# Altium project ESC_S1.PrjPcb
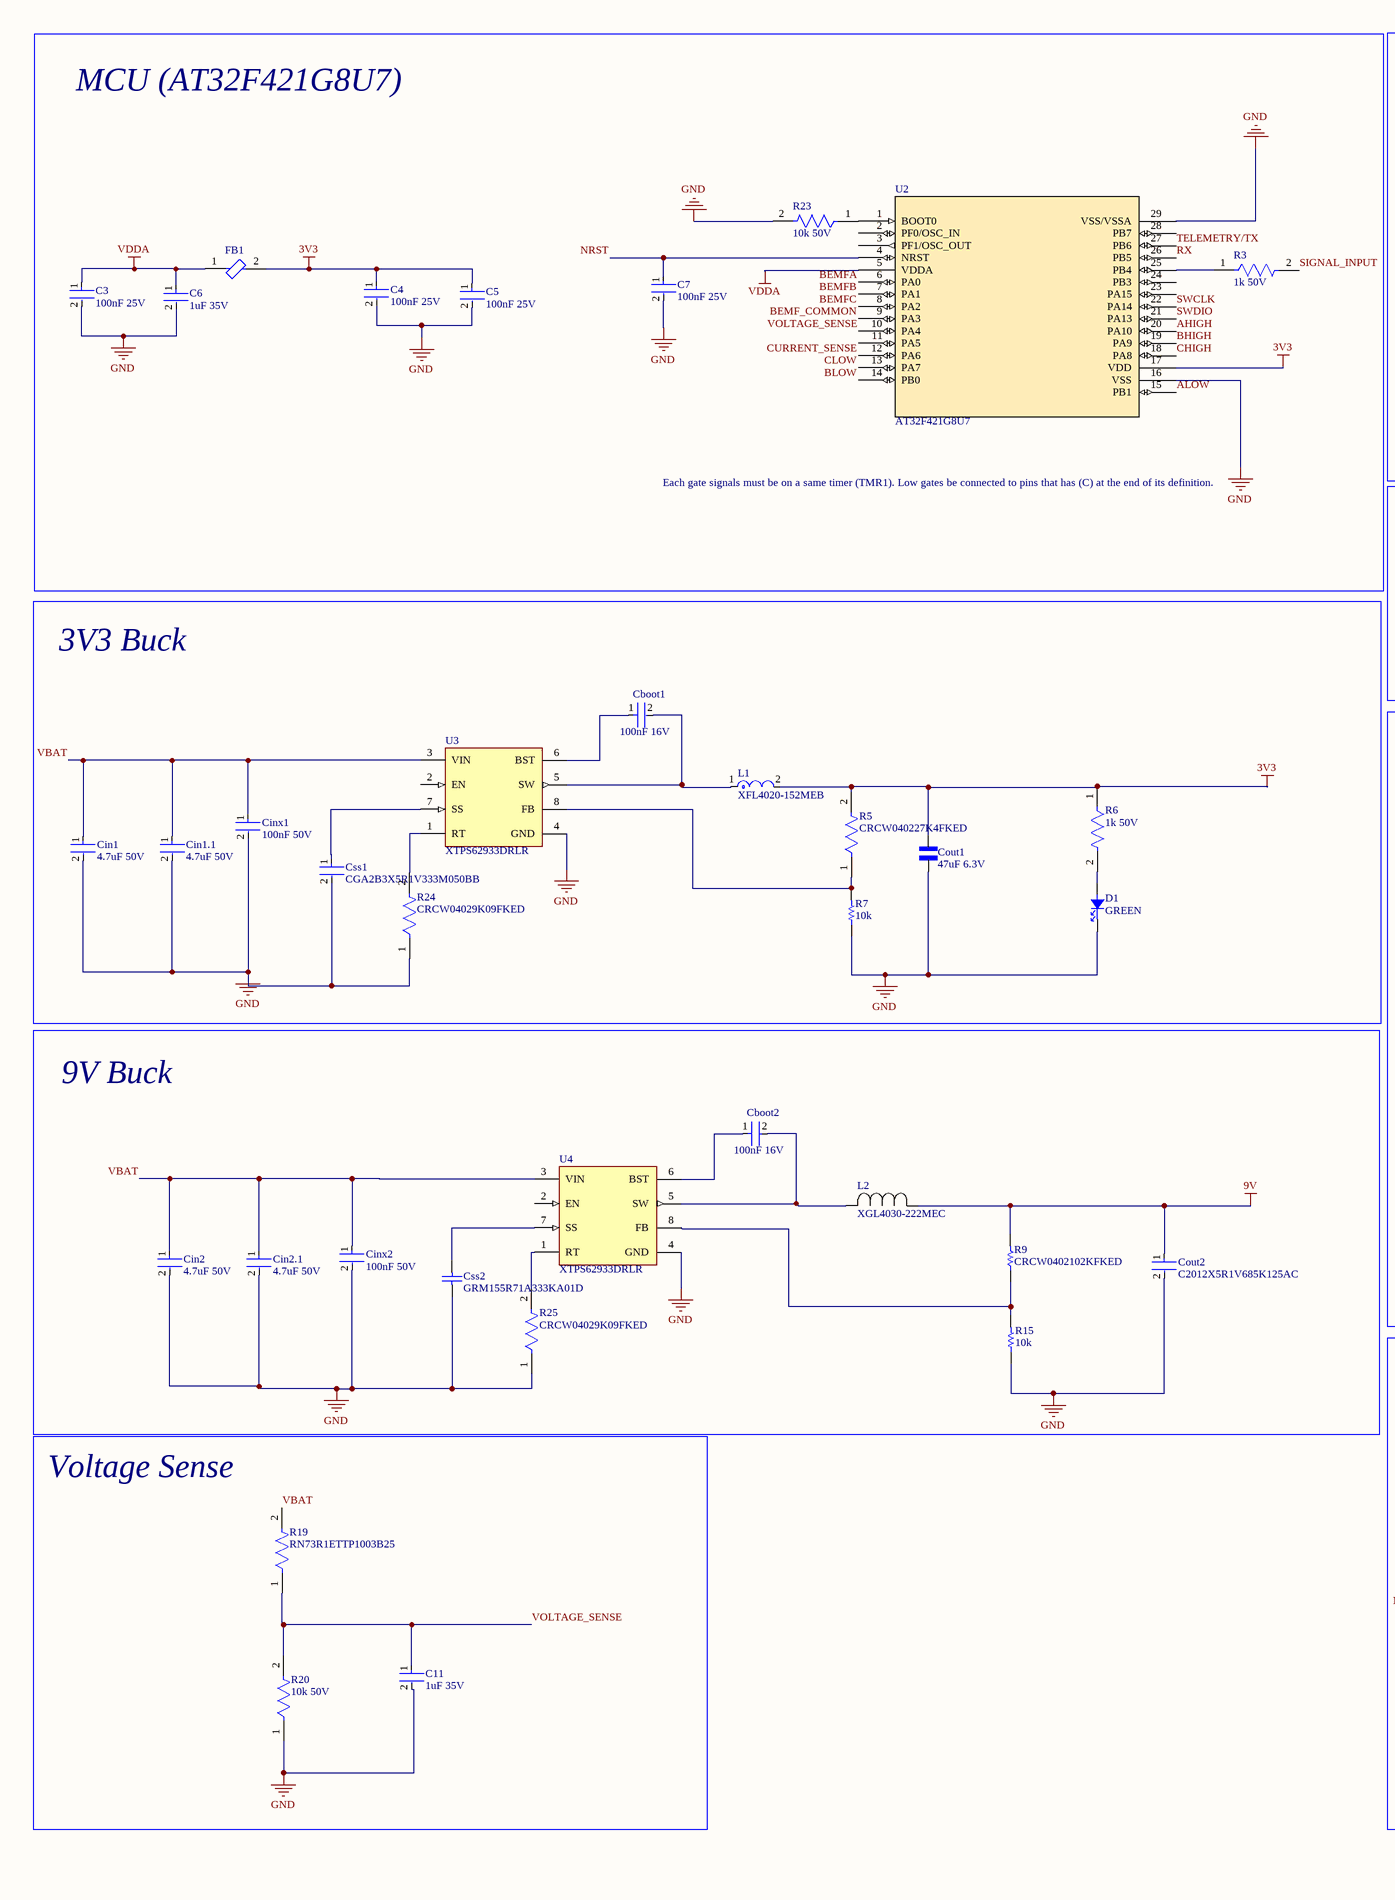
[diagram p0: ESC_S1.SchDoc, left]
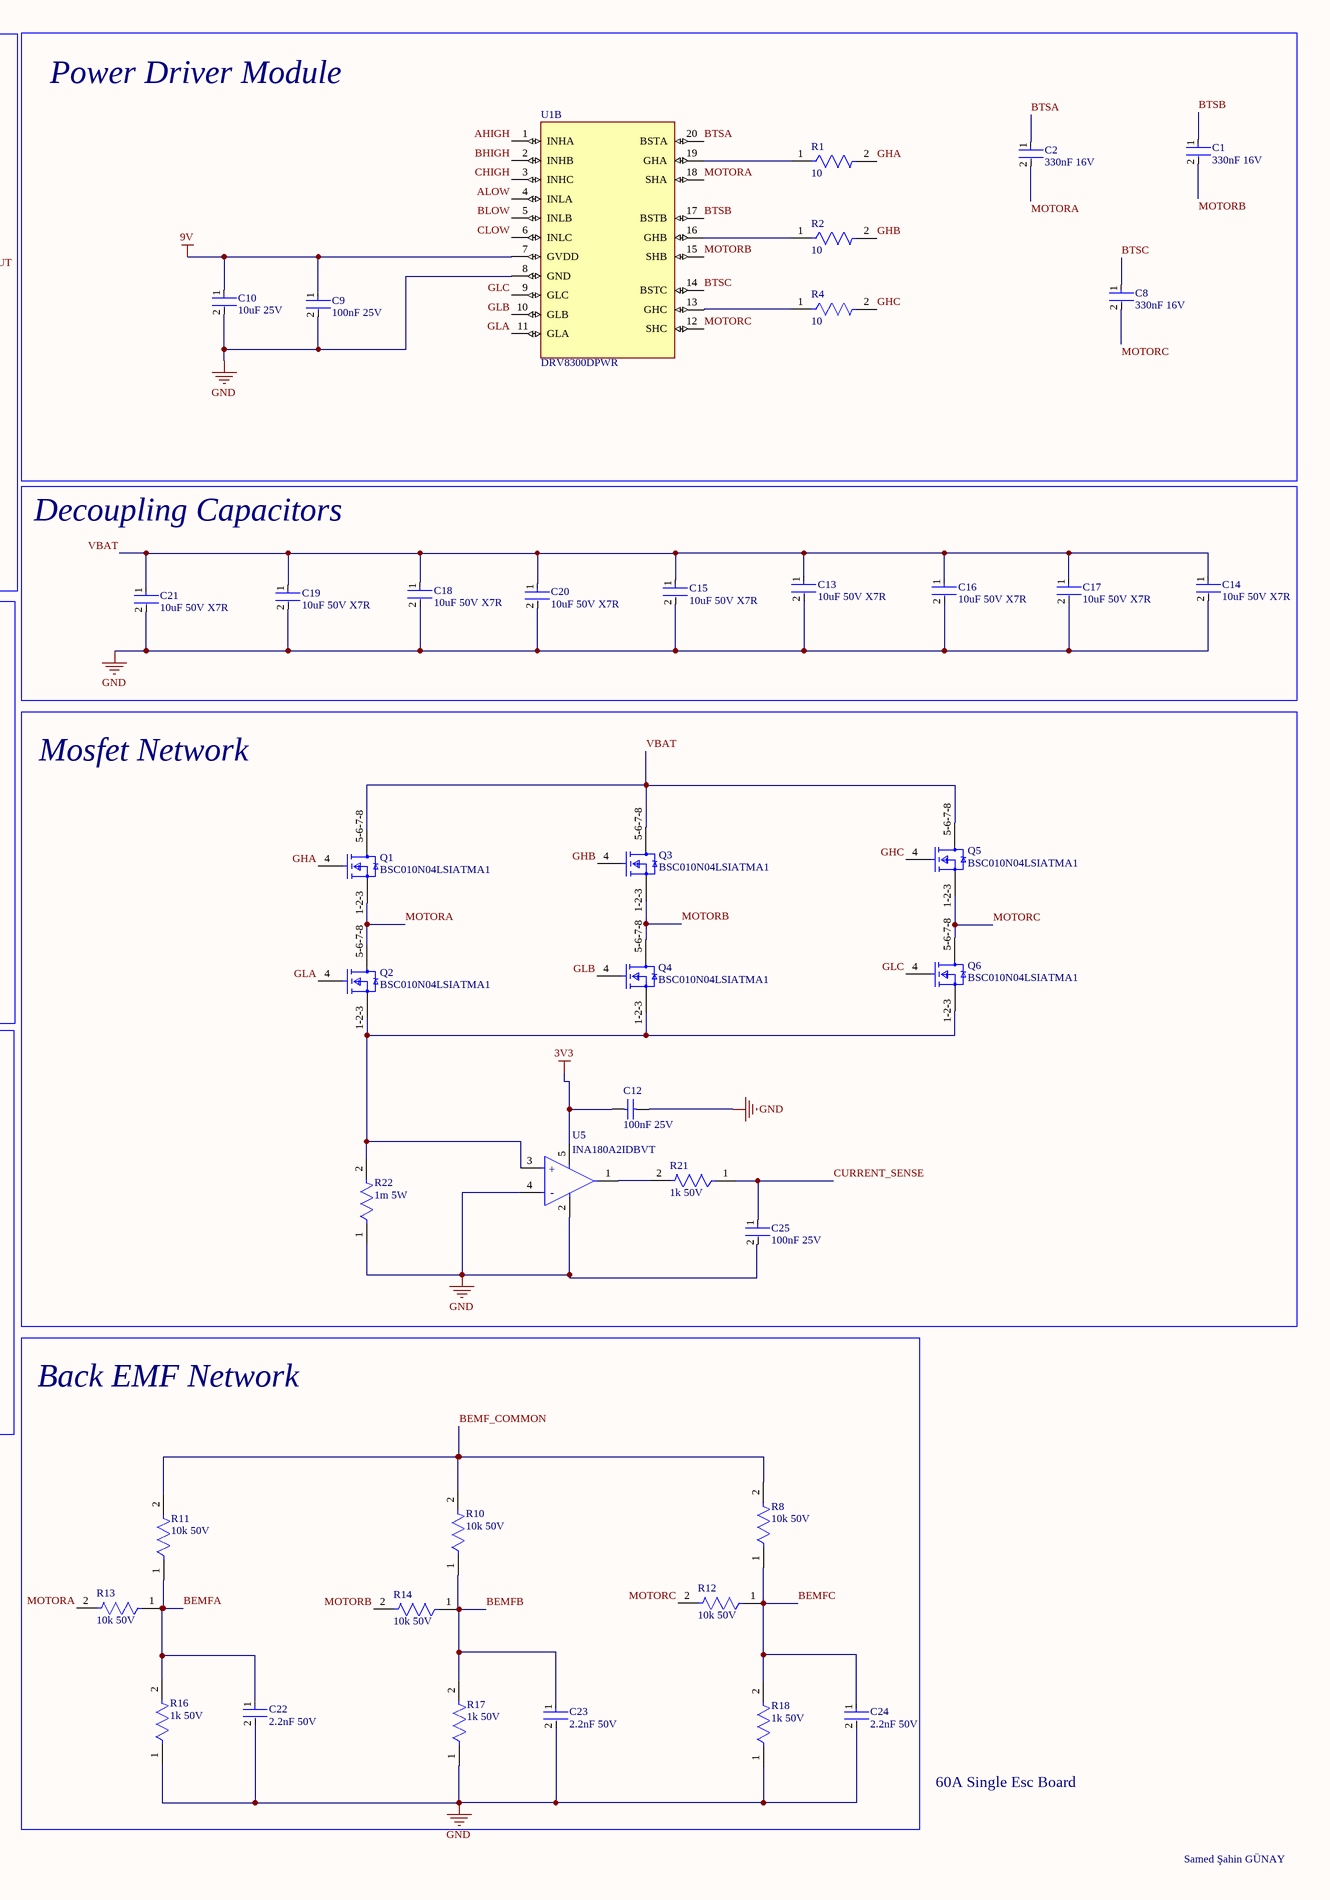
[diagram p1: ESC_S1.SchDoc, right]
1 sheet, 77 parts. Net scope: global (net labels, ports and power ports of the same name join across sheets).
Board file: ESC_S1.PcbDoc

## Sheet ESC_S1.SchDoc
size A2; SheetNumber: 1; SheetTotal: 1

### Parts
C1  330nF 16V  [FP-C0603C-CF-MFG]
C2  330nF 16V  [FP-C0603C-CF-MFG]
C3  100nF 25V  [FP-C0402-BB-MFG]
C4  100nF 25V  [FP-C0402-BB-MFG]
C5  100nF 25V  [FP-C0402-BB-MFG]
C6  1uF 35V  [FP-0402-L_1_0_0_2-W_0_5_0-MFG]
C7  100nF 25V  [FP-C0402-BB-MFG]
C8  330nF 16V  [FP-C0603C-CF-MFG]
C9  100nF 25V  [FP-C0402-BB-MFG]
C10  10uF 25V  [FP-ZRB18AR61E106ME01L-MFG]
C11  1uF 35V  [FP-0402-L_1_0_0_2-W_0_5_0-MFG]
C12  100nF 25V  [CAPC1608X87X35ML15T15]
C13  10uF 50V X7R  [FP-CL31B106KBHNNNE-MFG]
C14  10uF 50V X7R  [FP-CL31B106KBHNNNE-MFG]
C15  10uF 50V X7R  [FP-CL31B106KBHNNNE-MFG]
C16  10uF 50V X7R  [FP-CL31B106KBHNNNE-MFG]
C17  10uF 50V X7R  [FP-CL31B106KBHNNNE-MFG]
C18  10uF 50V X7R  [FP-CL31B106KBHNNNE-MFG]
C19  10uF 50V X7R  [FP-CL31B106KBHNNNE-MFG]
C20  10uF 50V X7R  [FP-CL31B106KBHNNNE-MFG]
C21  10uF 50V X7R  [FP-CL31B106KBHNNNE-MFG]
C22  2.2nF 50V  [FP-CL286-IPC_C]
C23  2.2nF 50V  [FP-CL286-IPC_C]
C24  2.2nF 50V  [FP-CL286-IPC_C]
C25  100nF 25V  [FP-C0402-BB-MFG]
Cboot1  100nF 16V  [FP-C0402-BB-MFG]
Cboot2  100nF 16V  [FP-C0402-BB-MFG]
Cin1  4.7uF 50V  [FP-CC0805-0_85-MFG]
Cin1.1  4.7uF 50V  [FP-CC0805-0_85-MFG]
Cin2  4.7uF 50V  [FP-CC0805-0_85-MFG]
Cin2.1  4.7uF 50V  [FP-CC0805-0_85-MFG]
Cinx1  100nF 50V  [FP-CGA3E-0_3-0_1-IPC_A]
Cinx2  100nF 50V  [FP-CGA3E-0_3-0_1-IPC_A]
Cout1  47uF 6.3V  [CAPC1608X100N]
Cout2  C2012X5R1V685K125AC  [FP-C2012-125-0_2-IPC_B]
Css1  CGA2B3X5R1V333M050BB  [FP-CGA2B-IPC_A]
Css2  GRM155R71A333KA01D  [CAPC1005X55X25NL05T10]
D1  GREEN  [LED0402G]
FB1  BLM15BD601SZ1D  [FP-BLM15-0_05-IPC_B]  (value not drawn)
L1  XFL4020-152MEB  [FP-XFL4020-MFG]
L2  XGL4030-222MEC  [IND_XGL4030_COC]
Q1  BSC010N04LSIATMA1  [FP-PG-TDSON-8-MFG]
Q2  BSC010N04LSIATMA1  [FP-PG-TDSON-8-MFG]
Q3  BSC010N04LSIATMA1  [FP-PG-TDSON-8-MFG]
Q4  BSC010N04LSIATMA1  [FP-PG-TDSON-8-MFG]
Q5  BSC010N04LSIATMA1  [FP-PG-TDSON-8-MFG]
Q6  BSC010N04LSIATMA1  [FP-PG-TDSON-8-MFG]
R1  10  [FP-AC0603-MFG]
R2  10  [FP-AC0603-MFG]
R3  1k 50V  [FP-AC0402-IPC_C]
R4  10  [FP-AC0603-MFG]
R5  CRCW040227K4FKED  [FP-CRCW0402-e3-MFG]
R6  1k 50V  [FP-AC0402-IPC_C]
R7  10k  [RESC1005X40X25ML05T10]
R8  10k 50V  [FP-MCS0402-IPC_C]
R9  CRCW0402102KFKED  [RESC1005X40X25ML05T05]
R10  10k 50V  [FP-MCS0402-IPC_C]
R11  10k 50V  [FP-MCS0402-IPC_C]
R12  10k 50V  [FP-MCS0402-IPC_C]
R13  10k 50V  [FP-MCS0402-IPC_C]
R14  10k 50V  [FP-MCS0402-IPC_C]
R15  10k  [RESC1005X40X25ML05T10]
R16  1k 50V  [FP-AC0402-IPC_C]
R17  1k 50V  [FP-AC0402-IPC_C]
R18  1k 50V  [FP-AC0402-IPC_C]
R19  RN73R1ETTP1003B25  [FP-RN73R1E-MFG]
R20  10k 50V  [FP-MCS0402-IPC_C]
R21  1k 50V  [FP-AC0402-IPC_C]
R22  1m 5W  [FP-WSLF2512-0_43-MFG]
R23  10k 50V  [FP-MCS0402-IPC_C]
R24  CRCW04029K09FKED  [FP-CRCW0402-e3-IPC_A]
R25  CRCW04029K09FKED  [FP-CRCW0402-e3-IPC_A]
U1  DRV8300DPWR  [SOP65P640X120-20N]  (part B of 2)
U2  AT32F421G8U7  [QFN28_4x4_ART]
U3  XTPS62933DRLR  [FP-DRL0008A-MFG]
U4  XTPS62933DRLR  [FP-DRL0008A-MFG]
U5  INA180A2IDBVT  [FP-DBV0005A-MFG]

### Blocks framed on the sheet
MCU (AT32F421G8U7): C3-C7 FB1 R3 R23 U2
Power Driver Module: C1 C2 C8-C10 R1 R2 R4 U1
Decoupling Capacitors: C13-C21
3V3 Buck: Cboot1 Cin1 Cin1.1 Cinx1 Cout1 Css1 D1 L1 R5-R7 R24 U3
Mosfet Network: C12 C25 Q1-Q6 R21 R22 U5
9V Buck: Cboot2 Cin2 Cin2.1 Cinx2 Cout2 Css2 L2 R9 R15 R25 U4
Back EMF Network: C22-C24 R8 R10-R14 R16-R18
Voltage Sense: C11 R19 R20

### Nets
3V3: C4.1 C5.1 C12.2 Cout1.2 FB1.2 L1.2 R5.2 R6.1 U2.17(VDD) U5.5(VS)
9V: C9.1 C10.1 Cout2.1 L2.1 R9.2 U1.7(GVDD)
GND: C3.2 C4.2 C5.2 C6.2 C7.2 C9.2 C10.2 C11.2 C12.1 C13.2 C14.2 C15.2 C16.2 C17.2 C18.2 C19.2 C20.2 C21.2 C22.2 C23.2 C24.2 C25.2 Cin1.2 Cin1.1.2 Cin2.2 Cin2.1.2 Cinx1.2 Cinx2.2 Cout1.1 Cout2.2 Css1.2 Css2.1 D1.1 R7.1 R15.1 R16.1 R17.1 R18.1 R20.1 R22.1 R23.2 R24.1 R25.1 U1.8(GND) U2.16(VSS) U2.29(VSS/VSSA) U3.4(GND) U4.4(GND) U5.2(GND) U5.4(IN-)
VDDA: C3.1 C6.1 FB1.1 U2.5(VDDA)
AHIGH: U1.1(INHA) U2.20(PA10)
ALOW: U1.4(INLA) U2.15(PB1)
BEMF_COMMON: R8.2 R10.2 R11.2 U2.9(PA3)
BEMFA: C22.1 R11.1 R13.1 R16.2 U2.6(PA0)
BEMFB: C23.1 R10.1 R14.1 R17.2 U2.7(PA1)
BEMFC: C24.1 R8.1 R12.1 R18.2 U2.8(PA2)
BHIGH: U1.2(INHB) U2.19(PA9)
BLOW: U1.5(INLB) U2.14(PB0)
BTSA: C2.1 U1.20(BSTA)
BTSB: C1.1 U1.17(BSTB)
BTSC: C8.1 U1.14(BSTC)
CHIGH: U1.3(INHC) U2.18(PA8)
CLOW: U1.6(INLC) U2.13(PA7)
CURRENT_SENSE: C25.1 R21.1 U2.12(PA6)
GHA: Q1.4(G) R1.2
GHB: Q3.4(G) R2.2
GHC: Q5.4(G) R4.2
GLA: Q2.4(G) U1.11(GLA)
GLB: Q4.4(G) U1.10(GLB)
GLC: Q6.4(G) U1.9(GLC)
MOTORA: C2.2 Q1.1-2-3(S) Q2.5-6-7-8(D) R13.2 U1.18(SHA)
MOTORB: C1.2 Q3.1-2-3(S) Q4.5-6-7-8(D) R14.2 U1.15(SHB)
MOTORC: C8.2 Q5.1-2-3(S) Q6.5-6-7-8(D) R12.2 U1.12(SHC)
NRST: C7.1 U2.4(NRST)
RX: U2.26(PB5)
SIGNAL_INPUT: R3.2
SWCLK: U2.22(PA14)
SWDIO: U2.21(PA13)
TELEMETRY/TX: U2.27(PB6)
VBAT: C13.1 C14.1 C15.1 C16.1 C17.1 C18.1 C19.1 C20.1 C21.1 Cin1.1 Cin1.1.1 Cin2.1 Cin2.1.1 Cinx1.1 Cinx2.1 Q1.5-6-7-8(D) Q3.5-6-7-8(D) Q5.5-6-7-8(D) R19.2 U3.3(VIN) U4.3(VIN)
VOLTAGE_SENSE: C11.1 R19.1 R20.2 U2.10(PA4)
NetCboot1_1: Cboot1.1 U3.6(BST)
NetCboot1_2: Cboot1.2 L1.1 U3.5(SW)
NetCboot2_1: Cboot2.1 U4.6(BST)
NetCboot2_2: Cboot2.2 L2.2 U4.5(SW)
NetCss1_1: Css1.1 U3.7(SS)
NetCss2_2: Css2.2 U4.7(SS)
NetD1_2: D1.2 R6.2
NetQ2_1-2-3: Q2.1-2-3(S) Q4.1-2-3(S) Q6.1-2-3(S) R22.2 U5.3(IN+)
NetR1_1: R1.1 U1.19(GHA)
NetR2_1: R2.1 U1.16(GHB)
NetR3_1: R3.1 U2.25(PB4)
NetR4_1: R4.1 U1.13(GHC)
NetR5_1: R5.1 R7.2 U3.8(FB)
NetR9_1: R9.1 R15.2 U4.8(FB)
NetR21_2: R21.2 U5.1(OUT)
NetR23_1: R23.1 U2.1(BOOT0)
NetR24_2: R24.2 U3.1(RT)
NetR25_2: R25.2 U4.1(RT)

Not connected (* = marked no-connect by the designer): U2 2(PF0/OSC_IN) 3(PF1/OSC_OUT) 11(PA5) 23(PA15) 24(PB3) 28(PB7); U3 2(EN); U4 2(EN)

### Notes on the sheet
- Each gate signals must be on a same timer (TMR1). Low gates be connected to pins that has (C) at the end of its definition.
- 60A Single Esc Board
- Samed Şahin GÜNAY
- (in symbol CMP-04895-000174-1) +; -

### Library data of the parts
C1 C2 C8 = CMP-03020-005049-1: CAP CER 0.33UF 16V X7R 0603; Manufacturer Part Number: C0603C334M4RACTU; Manufacturer: KEMET; Capacitance: 0.33 μF; Temperature Coefficient: 30ppm/°C; Material: Ceramic; Tolerance: 0.2; Automotive Grade: Grade 1; Value: 0.33 μF; Digikey Description: CAP CER 0.33UF 16V X7R 0603; Octopart: https://octopart.com/c0603c334m4ractu-kemet-9139753; Lead Free: Yes; Temperature Range Low: -55°C; RoHS: TRUE; ComponentLink2Description: Datasheet; Voltage Rating: 16 V; Mouser Description: Multilayer Ceramic Capacitors MLCC - SMD/SMT 16volts 0.33uF X7R 20%; Category: Cap; Temperature Characteristic: X7R; ComponentLink2URL: https://api.kemet.com/component-edge/download/datasheet/C0603C100J5GACAUTO.pdf; Device Class L3: Ceramic Capacitors; Automotive: Yes; Temperature: -55°C to +125°C; Temperature Range High: +125°C; Height: 0.87mm; Device Class L2: Capacitors; Package: C0603C-CF; Device Class L1: Passive Components
C3-C5 C7 C9 C25 = CMP-03020-014070-2: CAP CER 0.1UF 25V X5R 0402; Manufacturer: Kemet; Manufacturer Part Number: C0402C104M3PAC7867; Material: Ceramic; Tolerance: 0.2; Value: 0.10 μF; Temperature Coefficient: 15%; Height: 0.55mm; Category: Cap; Temperature: -55°C to +125°C; Automotive: No; Package: C0402-BB; Temperature Range Low: -55°C; ComponentLink2Description: Datasheet; Device Class L3: Ceramic Capacitors; ComponentLink2URL: https://content.kemet.com/datasheets/KEM_C1002_X7R_SMD.pdf; Octopart: https://octopart.com/c0402c104m3pac7867-kemet-84304880; Temperature Characteristic: X5R; RoHS: TRUE; Temperature Range High: +125°C; Device Class L1: Passive Components; Capacitance: 0.10 μF; Lead Free: Yes; Voltage Rating: 25 V; Ipc Land Pattern Name: CAPC10050X50; Device Class L2: Capacitors; Digikey Description: CAP CER 0.1UF 25V X5R 0402
C6 C11 = CMP-14477-003658-1: Ceramic Capacitor General Use 1uF ±10% 35V X6S 0402
C10 = CMP-06035-062385-2: CAP CER 10UF 25V X5R 0603; Tolerance: 20%; Min Operating Temperature: -55°C; Voltage: 25V; Case Code (Imperial): 0603; Case Code (Metric): 1608; Voltage Rating (DC): 25V; Max Operating Temperature: 85°C; Depth: 0.8mm; Thickness: 0.047inch; RoHS Compliant: Yes; Dielectric: X5R; Mount: Surface Mount; Voltage Rating: 25V; Length: 0.063inch; Height: 1mm; Packaging: Cut Tape; Capacitance: 10uF; REACH SVHC: No SVHC; Width: 0.031inch; Case/Package: 0603
C12 = CMP-2006-03295-1: Part Number: C0603T104K3RCLTU; Manufacturer: Kemet
C13-C21 = CMP-2000-07530-2: CAP CER 10UF 50V X7R 1206; Manufacturer: Samsung; Manufacturer Part Number: CL31B106KBHNNNE; Tolerance: 10%; Material: Ceramic; Temperature Coefficient: 15%; Temperature Characteristic: X7R; Digikey Description: CAP CER 10UF 50V X7R 1206; Device Class L1: Passive Components; Value: 10uF; Lead Free: Yes; Device Class L3: Ceramic Capacitors; Octopart: https://octopart.com/cl31b106kbhnnne-samsung-30507377; ComponentLink2URL: http://www.samsungsem.com/global/front/downloadcms.do?path=%2F%2Fglobal%2F%2Fsupport%2F%2Fproduct-search%2F%2Fmlcc%2F%2F__icsFiles%2F%2Fafieldfile%2F%2F2019%2F%2F06%2F%2F18&fileName=CL31B106KBHNNNE-19.pdf; Voltage Rating: 50V; Temperature Range Low: -55°C; RoHS: TRUE; Temperature: -55°C to +125°C; Category: Cap; ComponentLink2Description: Datasheet; Automotive: No; Device Class L2: Capacitors; Capacitance: 10uF; Height: 1.8mm; Temperature Range High: +125°C; Package: CL31B106KBHNNNE
C22-C24 = CMP-13271-000679-1: Cap Ceramic 2.2nF 50V X7R ±10% SMD 0402 +125°C Paper T/R; Min Operating Temperature: -55°C; Case/Package: 0402; Voltage Rating (DC): 50V; Packaging: Tape and Reel; Package Quantity: 1; Tolerance: 10%; Height: 0.5mm; Voltage Rating: 50V; Width: 0.02inch; Case Code (Imperial): 0402; Capacitance: 2.2nF; Depth: 0.5mm; Dielectric: X7R; Length: 0.039inch; Thickness: 0.022inch; Case Code (Metric): 1005; Mount: Surface Mount; Radiation Hardening: No; Max Operating Temperature: 125°C
Cboot1 Cboot2 = CMP-2008-03082-2: CAP CER 0.1UF 16V X7R 0402; Manufacturer Part Number: C0402C104K4RACAUTO; Manufacturer: Kemet; Temperature Coefficient: 15%; Tolerance: 0.1; Capacitance: 0.10 μF; Value: 0.10 μF; Device Class L3: Ceramic Capacitors; Voltage Rating: 16 V; Temperature Range High: +125°C; Device Class L2: Capacitors; Height: 0.55mm; Category: Cap; RoHS: TRUE; Temperature Characteristic: X7R; Octopart: https://octopart.com/c0402c104k4racauto-kemet-17309149; Digikey Description: CAP CER 0.1UF 16V X7R 0402; Device Class L1: Passive Components; Temperature Range Low: -55°C; Material: Ceramic; Mouser Description: Cap Ceramic 0.1uF 16V X7R 10% Pad SMD 0402 125C Automotive T/R; ComponentLink2Description: Datasheet; Automotive: No; Ipc Land Pattern Name: CAPC10050X50; ComponentLink2URL: https://content.kemet.com/datasheets/KEM_C1002_X7R_SMD.pdf; Lead Free: Yes; Temperature: -55°C to +125°C; Package: C0402-BB
Cin1 Cin1.1 Cin2 Cin2.1 = CMP-03422-000966-1: CAP CER 4.7UF 50V X5R 0805; Manufacturer: Yageo; Manufacturer Part Number: CC0805KKX5R9BB475; Tolerance: 0.1; Capacitance: 4.7 uF; Value: 4.7 uF; Height: 0.95mm; Category: Cap; ComponentLink2Description: Datasheet; Lead Free: Yes; Voltage Rating: 50 V; Device Class L2: Capacitors; Material: Ceramic; Temperature Range High: +85°C; ComponentLink2URL: http://www.yageo.com/documents/recent/UPY-GPHC_Y5V_6.3V-to-50V_8.pdf; Ipc Land Pattern Name: CAPC200125X85; Octopart: https://octopart.com/cc0805kkx5r9bb475-yageo-81932641; Temperature Range Low: -30°C; Digikey Description: CAP CER 4.7UF 50V X5R 0805; Package: CC0805-0.85; Device Class L1: Passive Components; RoHS: TRUE; Temperature Characteristic: X5R; Device Class L3: Ceramic Capacitors; Automotive: No; Temperature: -30°C to +85°C; Footprint Url: http://www.yageo.com/exep/pages/download/literatures/UPY-C_GEN_24.pdf
Cinx1 Cinx2 = CMP-2000-07546-2: Cap Ceramic 100nF 50V X7R 10% Pad SMD 0603 +125°C Automotive T/R; Weight: 7.1E-05oz; Composition: Ceramic; Max Operating Temperature: 125°C; Termination: SMD/SMT; Dielectric: X7R; Length: 1.6mm; Package Quantity: 1; REACH SVHC: No SVHC; Lead Free: Lead Free; Case Code (Metric): 1608; Min Operating Temperature: -55°C; Packaging: Tape and Reel; Tolerance: 10%; Voltage Rating: 50V; Case Code (Imperial): 0603; Capacitance: 100nF; Case/Package: 0603; Voltage Rating (DC): 50V; Depth: 0.8mm; Radiation Hardening: No; Ratings: AEC-Q200; Mount: Surface Mount; Voltage: 50V; Thickness: 0.035inch; Width: 0.8mm; Height: 0.8mm
Cout1 = MSASJ168BB5476MRCA01: 47uF 6.3V 20% Multilayer Ceramic Capacitor X5R 0603 (1608 Metric); MF: Taiyo Yuden; SnapEDA_Link: https://www.snapeda.com/parts/MSASJ168BB5476MRCA01/Taiyo+Yuden/view-part/?ref=snap; Package: 1608-2 TAIYO; Value: *; MP: MSASJ168BB5476MRCA01; Check_prices: https://www.snapeda.com/parts/MSASJ168BB5476MRCA01/Taiyo+Yuden/view-part/?ref=eda
Cout2 = CMP-08246-006695-1: Multilayer Ceramic Capacitors 6.8μF ±10% 35V X5R SMD 0805; Capacitance: 6.8uF; Case Code (Imperial): 0805; Width: 0.049inch; Thickness: 0.057inch; Case/Package: 0805; Packaging: Tape and Reel; Min Operating Temperature: -55°C; Dielectric Material: Ceramic; Lead Free: Lead Free; Case Code (Metric): 2012; Series: C; RoHS Compliant: Yes; Length: 0.079inch; Max Operating Temperature: 85°C; Mount: Surface Mount; Voltage Rating: 35V; Package Quantity: 2000; Tolerance: 10%; Voltage Rating (DC): 35V
Css1 = CMP-08246-000404-1: Cap Ceramic 33nF 35V X5R 20% Pad SMD 0402 +85°C Automotive T/R; Case Code (Metric): 1005; Max Operating Temperature: 85°C; Case Code (Imperial): 0402; Dielectric: X5R; Voltage Rating (DC): 35V; Voltage Rating: 35V; Length: 0.039inch; Tolerance: 20%; Package Quantity: 10000; Width: 0.5mm; Packaging: Tape and Reel; Thickness: 0.022inch; Height: 0.5mm; Weight: 2.3E-05oz; Capacitance: 33nF; Min Operating Temperature: -55°C; Mount: Surface Mount; Ratings: AEC-Q200; Case/Package: 0402
Css2 = CMP-2008-04594-1: Manufacturer: Murata; Part Number: GRM155R71A333KA01D
D1 = VLMG1500-GS08: LED YLW-GRN 0402 SMD; Manufacturer: Vishay; Color: Green,Yellow; Lens Color: Clear; Viewing Angle: 130°; Forward Current: 30mA; Forward Voltage: 2V; Luminous Intensity: 35mcd; Dominant Wavelength: 571nm; Test Current: 20mA; Number of Elements: 1; Power Dissipation: 75mW; Lens Style: Rectangular; Reverse Voltage: 5V; Supplier: Digikey; Supplier Part Number: VLMG1500-GS08CT-ND; Manufacturer Part Number: VLMG1500-GS08; RoHS: Yes; Category: LEDs; Stock: 98; Pricing: 1=0.34, 10=0.265, 100=0.119, 500=0.10746, 1000=0.08827 (USD); Mounting Technology: Surface Mount; Case/Package: 0402; Pins: 2; Case Code (Metric): 1005; Case Code (Imperial): 0402; Min Operating Temperature: -30°C; Max Operating Temperature: 85°C; Package Quantity: 1; Packaging: Tape and Reel; Illumination Color: Green; Wavelength: 571nm; Number of LEDs: 1; Power Rating: 75mW; Series: CHipLED; Length: 1mm; Width: 0.5mm; Height: 0.35mm; Depth: 0.5mm; Radiation Hardening: No; Lead Free: Lead Free; RoHS Compliant: Yes; Reach SVHC Compliant: Unknown; ComponentLink1URL: https://datasheet.ciiva.com/12071/vlmo1500-244705-12071911.pdf?src-supplier=Mouser; ComponentLink1Description: https://datasheet.ciiva.com/12071/vlmo1500-244705-12071911.pdf?src-supplier=Mouser; ComponentLink2URL: https://datasheet.ciiva.com/30005/vlmo1500-30005134.pdf?src-supplier=Avnet; ComponentLink2Description: https://datasheet.ciiva.com/30005/vlmo1500-30005134.pdf?src-supplier=Avnet; LCSC Part Number: C511404
FB1 = CMP-06046-002695-1: Chip Ferrite Bead, 0402, 600Ω @ 100MHz, 0.65Ω, 25%, 200mA; RoHS Compliant: Yes
L1 = CMP-11268-000205-1: Power inductor, shielded, 1.5uH 20% 15.8mOhm 6.7A, SMT, RoHS, halogen free; DC Resistance (DCR): 15.8mR; Core Material: Composite; Self Resonant Frequency: 59MHz; Max DC Current: 9.1A; Test Frequency: 100kHz; Max Operating Temperature: 125°C; Height: 2.1mm; Tolerance: 20%; Inductance: 1.5uH; Width: 4.3mm; Lead Free: Contains Lead; Termination: SMD/SMT; Packaging: Tape and Reel; Shielding: Shielded; Series: XFL4020; Min Operating Temperature: -40°C; RoHS Compliant: Yes; Package Quantity: 25; Length: 4.3mm
L2 = XGL4030-222MEC: Description; Manufacturer_Name: Coilcraft; Copyright: Copyright (C) 2025 Ultra Librarian. All rights reserved.; Manufacturer_Part_Number: XGL4030-222MEC
Q1-Q6 = CMP-32901-000662-1: MOSFET N-CH 40V 37A/100A TDSON; Rise Time: 48ns; Rds On Max: 1.05mR; Power Dissipation: 2.5W; Input Capacitance: 6.2nF; Continuous Drain Current (ID): 100A; Number of Elements: 1; Gate to Source Voltage (Vgs): 20V; Max Power Dissipation: 139W; RoHS Compliant: Yes; Min Operating Temperature: -55°C; Mount: Surface Mount; Number of Pins: 8; Series: OptiMOS™; Drain to Source Voltage (Vdss): 40V; Packaging: Tape and Reel; Max Operating Temperature: 150°C
R1 R2 R4 = CMP-03412-039150-1: RES 10Ω 5.00% 0.1W 0603
R3 R6 R16-R18 R21 = CMP-03412-047873-1: RES 1kΩ ±1% 0.063W 0402; RoHS Compliant: Yes
R5 = CMP-2002-08433-2: RES Thick Film, 27.4kΩ, 1%, 0.063W, 100ppm/°C, 0402; Voltage Rating: 50V; Resistance: 27.4kR; Power Rating: 63mW; Case/Package: 0402; Military Standard: Not; Radiation Hardening: No; Max Operating Temperature: 155°C; Case Code (Metric): 1005; Composition: Thick Film; Depth: 0.5mm; Package Quantity: 10; Max Power Dissipation: 63mW; Number of Pins: 2; Features: Automotive AEC-Q200; Packaging: Tape and Reel; Lead Free: Lead Free; Width: 0.02inch; Mount: Surface Mount; Tolerance: 1%; Contact Plating: Tin; Voltage Rating (DC): 50V; Number of Terminations: 2; Min Operating Temperature: -55°C; Weight: 2.3E-05oz; Height: 0.35mm; Case Code (Imperial): 0402; Temperature Coefficient: 100ppm/°C; Length: 1mm; Termination: SMD/SMT
R7 R15 = CMP-2002-03043-1: Part Number: CRCW040210K0FKEDHP; Manufacturer: Vishay Dale
R8 R10-R14 R20 R23 = CMP-2002-02447-2: RES SMD 1.2K OHM 1% 1/10W 0402; Temperature Coefficient: 25ppm/°C; Resistance: 10kR; Max Power Dissipation: 63mW; Tolerance: 0.1%; Height: 0.015inch; Composition: Thin Film; Width: 0.02inch; Max Operating Temperature: 125°C; Length: 0.039inch; Packaging: Tape and Reel; Contact Plating: Tin; Lead Free: Lead Free; Package Quantity: 10000; Depth: 0.5mm; Number of Terminations: 2; Military Standard: Not; Case/Package: 0402; Min Operating Temperature: -55°C
R9 = CMP-1011-00737-2: Manufacturer: Vishay Dale; Part Number: CRCW0402102KFKED
R19 = CMP-04015-069824-1: 100kΩ ±0.1% 0.063W, 1/16W Chip Resistor 0402 (1005 Metric) Moisture Resistant Thin Film
R22 = CMP-02407-013110-1: RES 0.001 OHM 1% 5W 2512; Resistance: 1mR; Temperature Coefficient: 170ppm/°C; Series: WSLF; RoHS Compliant: Yes; Min Operating Temperature: -65°C; Features: Moisture Resistant; Number of Terminations: 2; Case Code (Metric): 6432; Lead Free: Lead Free; Tolerance: 1%; Case Code (Imperial): 2512; Width: 0.125inch; Max Operating Temperature: 170°C; Case/Package: 2512; Resistor Type: Metal Element; Ratings: AEC-Q200; Packaging: Cut Tape; Height: 0.024inch; Max Power Dissipation: 5W; Length: 0.25inch
R24 R25 = CMP-2002-00285-2: RES Thick Film, 9.09kΩ, 1%, 0.063W, 100ppm/°C, 0402; Voltage Rating (DC): 50V; Resistance: 9.09kR; Max Power Dissipation: 63mW; Radiation Hardening: No; Number of Pins: 2; Lead Free: Lead Free; Weight: 2.3E-05oz; Contact Plating: Tin; Tolerance: 1%; Depth: 0.5mm; Mount: Surface Mount; Composition: Thick Film; Voltage Rating: 50V; Features: Automotive AEC-Q200; Packaging: Tape and Reel; Power Rating: 63mW; Height: 0.35mm; Min Operating Temperature: -55°C; Number of Terminations: 2; Package Quantity: 10; Case Code (Imperial): 0402; Temperature Coefficient: 100ppm/°C; Case/Package: 0402; Max Operating Temperature: 155°C; Military Standard: Not; Termination: SMD/SMT; Case Code (Metric): 1005; Width: 0.02inch; Length: 1mm
U2 = AT32F421G8U7: Description; Manufacturer_Name: ARTERY; Copyright: Copyright (C) 2026 Ultra Librarian. All rights reserved.; Manufacturer_Part_Number: AT32F421G8U7; RefDes: RefDes; Type: Type
U3 U4 = CMP-04918-000610-1: 3.8-V to 30-V, 3-A, 200-kHz to 2.2-MHz, low-IQ synchronous buck converter in SOT-583 package 8-SOT-5X3 -40 to 150
U5 = CMP-04895-000174-1: IC CURR SENSE 1 CIRCUIT SOT23-5; Number of Circuits: 1; Input Offset Voltage (Vos): 100uV; Operating Supply Current: 260uA; -3db Bandwidth: 350kHz; Slew Rate: 2V/µs; Input Bias Current: 100nA; Min Operating Temperature: -40°C; Mount: Surface Mount; RoHS Compliant: Yes; Packaging: Tape and Reel; Case/Package: SOT-23-5; Max Operating Temperature: 125°C